# Altium schematic sheet Sheet3.SchDoc
size A4
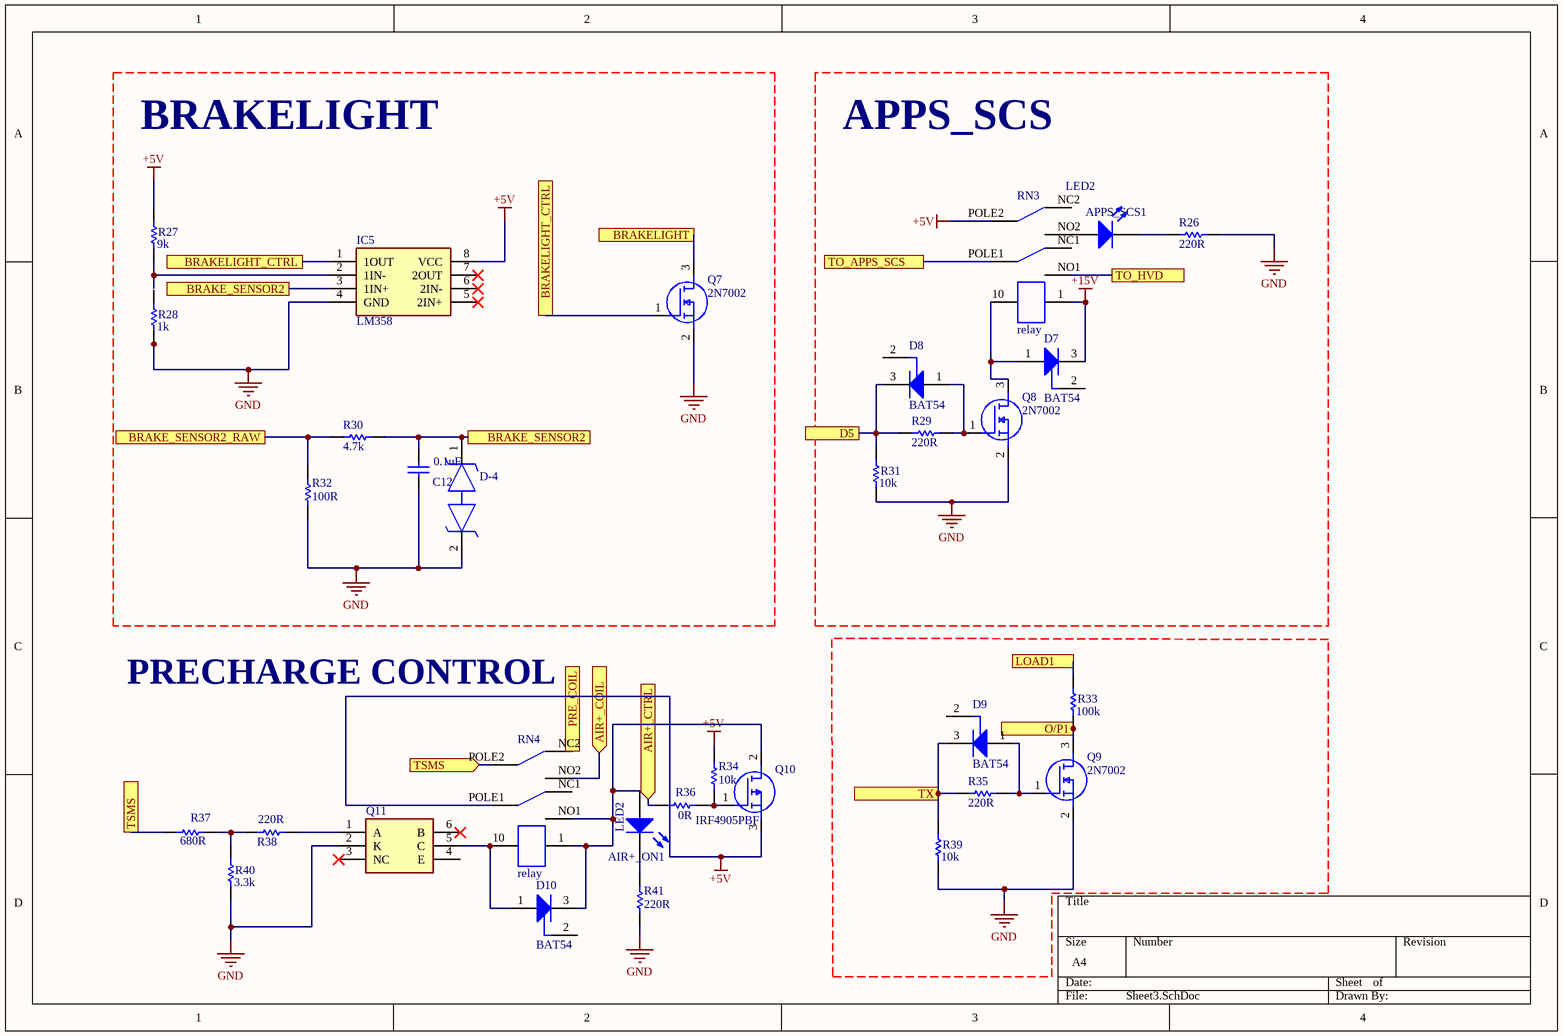
[diagram p0: Sheet3.SchDoc]

## Parts
AIR+_ON1  LED2  [3.2X1.6X1.1]
APPS_SCS1  LED2  [3.2X1.6X1.1]
C12  0.1uF  [KEMT-1206-2_N]
D7  BAT54  [INF-SOT23_N]
D8  BAT54  [INF-SOT23_N]
D9  BAT54  [INF-SOT23_N]
D10  BAT54  [INF-SOT23_N]
D-4  TPD1E6B06DPLR  [R1206]  (value not drawn)
IC5  LM358  [SOP100P600X150-8N]
Q7  2N7002  [SOT96P240X120-3N]
Q8  2N7002  [SOT96P240X120-3N]
Q9  2N7002  [SOT96P240X120-3N]
Q10  IRF4905PBF  [TO254P469X1042X1967-3P]
Q11  MCT2ESM  [SOT254P916X480-6N]  (value not drawn)
R26  220R  [RESC3216X60X45NL10T20 - duplicate]
R27  9k  [RESC3216X60X45NL10T20 - duplicate]
R28  1k  [RESC3216X60X45NL10T20 - duplicate]
R29  220R  [RESC3216X60X45NL10T20 - duplicate]
R30  4.7k  [RESC3216X60X45NL10T20 - duplicate]
R31  10k  [RESC3216X60X45NL10T20 - duplicate]
R32  100R  [RESC3216X60X45NL10T20 - duplicate]
R33  100k  [RESC3216X60X45NL10T20 - duplicate]
R34  10k  [R1206]
R35  220R  [RESC3216X60X45NL10T20 - duplicate]
R36  0R  [R1206]
R37  680R  [RESC3216X60X45NL10T20 - duplicate]
R38  220R  [RESC3216X60X45NL10T20 - duplicate]
R39  10k  [RESC3216X60X45NL10T20 - duplicate]
R40  3.3k  [RESC3216X60X45NL10T20 - duplicate]
R41  220R  [R1206]
RN3  relay  [relaytq]
RN4  relay  [relaytq]

## Blocks framed on the sheet
BRAKELIGHT: C12 D-4 IC5 Q7 R27 R28 R30 R32
APPS_SCS: APPS_SCS1 D7 D8 Q8 R26 R29 R31 RN3

## Ports
AIR+_COIL (in), AIR+_CTRL (in), BRAKE_SENSOR2, BRAKE_SENSOR2_RAW, BRAKELIGHT, BRAKELIGHT_CTRL, D5, LOAD1, O/P1, PRE_COIL, TO_APPS_SCS, TO_HVD, TSMS, TSMS (in), TX

## Nets
+5V: IC5.8(VCC) Q10.3(S) R27.2 R34.2 RN3.POLE2 RN4.POLE1
+15V: D7.3(K) RN3.1
GND: C12.1 D-4.2 IC5.4(GND) Q7.2(S) Q8.2(S) Q9.2(S) Q11.2(K) R26.1 R28.1 R31.1 R32.2 R39.1 R40.1 R41.2
AIR+_COIL: RN4.NO2 ; port AIR+_COIL
AIR+_CTRL: R36.1 ; port AIR+_CTRL
BRAKE_SENSOR2: C12.2 D-4.1 IC5.3(1IN+) R30.1 ; port BRAKE_SENSOR2
BRAKE_SENSOR2_RAW: R30.2 R32.1 ; port BRAKE_SENSOR2_RAW
BRAKELIGHT: Q7.3(D) ; port BRAKELIGHT
BRAKELIGHT_CTRL: IC5.1(1OUT) Q7.1(G) ; port BRAKELIGHT_CTRL
D5: D8.3(K) R29.2 R31.2 ; port D5
LOAD1: R33.2 ; port LOAD1
O/P1: Q9.3(D) R33.1 ; port O/P1
PRE_COIL: RN4.NC2 ; port PRE_COIL
TO_APPS_SCS: RN3.POLE1 ; port TO_APPS_SCS
TO_HVD: RN3.NO1 ; port TO_HVD
TSMS: R37.2 RN4.POLE2 ; port TSMS
TX: D9.3(K) R35.2 R39.2 ; port TX
NetAIR+_ON1_1: AIR+_ON1.1(A) D10.3(K) Q10.2(D) RN4.1 RN4.NO1
NetAIR+_ON1_2: AIR+_ON1.2(K) R41.1
NetAPPS_SCS1_1: APPS_SCS1.1(A) RN3.NO2
NetAPPS_SCS1_2: APPS_SCS1.2(K) R26.2
NetD7_1: D7.1(A) Q8.3(D) RN3.10
NetD8_1: D8.1(A) Q8.1(G) R29.1
NetD9_1: D9.1(A) Q9.1(G) R35.1
NetD10_1: D10.1(A) Q11.5(C) RN4.10
NetIC5_2: IC5.2(1IN-) R27.1
NetQ10_1: Q10.1(G) R34.1 R36.2
NetQ11_1: Q11.1(A) R38.1
NetR37_1: R37.1 R38.2 R40.2

Not connected (* = marked no-connect by the designer): D7 2(NC); D8 2(NC); D9 2(NC); D10 2(NC); IC5 5(2IN+)* 6(2IN-)* 7(2OUT)*; Q11 3(NC)* 4(E) 6(B)*; R28 2; RN3 NC1 NC2; RN4 NC1

## Notes on the sheet
- PRECHARGE CONTROL

## Library data of the parts
AIR+_ON1 APPS_SCS1 = LED2: Typical RED, GREEN, YELLOW, AMBER GaAs LED; Published: 8-Jun-2000; LatestRevisionDate: 17-Jul-2002; LatestRevisionNote: Re-released for DXP Platform.; PackageVersion: Feb-2002; PackageReference: 3.2X1.6X1.1; Publisher: Altium Limited; PackageDescription: SM LED; 2 Flat Leads
C12 = CAPACITOR: CAP, Ceramic, 0.1 uF, +/- 10%, 50 V, -55 to 125 degC, 1206 (3216 Metric), RoHS, Tape and Reel; Manufacturer: Kemet; Voltage Rating: 50V; Capacitance: 0.1µF; Product Range: KEMET-CSeries; SVHC: ToBeAdvised; Dielectric Characteristic: X7R; Capacitor Case Style: 1206[3216Metric]; Package Reference: 1206-2; Package Description: 2-Leads SMD, Body 3.2 x 1.6 mm; Packaging: Tape&Reel; Operating Temperature Max: 125degC; Capacitance Tolerance: ±10%; Datasheet URL: https://datasheet.ciiva.com/6125/1725438-6125494.pdf; Manufacturer URL: http://www.kemet.com/; Operating Temperature Min: -55degC; Datasheet Version: Jul-13
D7-D10 = CMP-1182-00010-1: Silicon Schottky Diode, SOT23, Reel, Green; Manufacturer: Infineon; VF (max): 800Â mV; Configuration: Single; IF (max): 200Â mA; CT (max): 10Â pF; Green: TRUE; VR (max): 30Â V; PartNumber: BAT54; ComponentLink2URL: http://www.infineon.com/dgdl/bat54series.pdf?folderId=db3a30431400ef68011425f1ca2505e3&fileId=db3a304314dca3890115190b74210ea6; ComponentLink3Description: Package Specification; PackageVersion: Apr-08; PackageDescription: 3-Pin Small Outline Transistor Package, 1.3 x 2.9 mm Body, 0.95 mm Pitch; ComponentLink1Description: Manufacturer URL; ComponentLink1URL: http://www.infineon.com/; Mounting Technology: Surface Mount; Packing: Reel; ComponentLink2Description: Datasheet; PackageReference: SOT23; ComponentLink3URL: http://www.infineon.com/dgdl/SOT23-Package_Overview.pdf?folderId=db3a30431936bc4b0119532290053c66&fileId=db3a30431936bc4b0119533468123c85
IC5 = LM358: Integrated Circuit; Manufacturer_Name: IDCHIP; Datasheet Link: https://datasheet.lcsc.com/szlcsc/1902201702_IDCHIP-LM358_C329455.pdf; Height: 1.5mm; Manufacturer_Part_Number: LM358
Q7-Q9 = 2N7002: MOSFET (N-Channel); Manufacturer_Name: Vishay; Datasheet Link: https://www.diodes.com/assets/Datasheets/ds11303.pdf; Height: 1.2mm; Manufacturer_Part_Number: 2N7002; Mouser Part Number: 781-2N7002; Mouser Price/Stock: https://www.mouser.co.uk/ProductDetail/Vishay-Siliconix/2N7002?qs=xBpwZ0JX2zKeuvZKtdYLZQ%3D%3D
Q10 = IRF4905PBF: MOSFET (P-Channel); Manufacturer_Name: Infineon; Datasheet Link: http://docs-emea.rs-online.com/webdocs/0791/0900766b807910f2.pdf; Height: 4.69mm; Manufacturer_Part_Number: IRF4905PBF; Mouser Part Number: 942-IRF4905PBF; Mouser Price/Stock: https://www.mouser.co.uk/ProductDetail/Infineon-IR/IRF4905PBF/?qs=9%252BKlkBgLFf39l0HsWdxvdw%3D%3D; Arrow Part Number: IRF4905PBF; Arrow Price/Stock: https://www.arrow.com/en/products/irf4905pbf/infineon-technologies-ag
Q11 = MCT2ESM: Phototransistor; Manufacturer_Name: ON Semiconductor; Datasheet Link: https://www.onsemi.com/pub/Collateral/MCT2EM-D.PDF; Height: 4.8mm; Manufacturer_Part_Number: MCT2ESM; Mouser Part Number: 512-MCT2ESM; Mouser Price/Stock: https://www.mouser.co.uk/ProductDetail/ON-Semiconductor-Fairchild/MCT2ESM/?qs=nW0pe8qlIZjLnc6UyUzYTw%3D%3D; Arrow Part Number: MCT2ESM; Arrow Price/Stock: https://www.arrow.com/en/products/mct2esm/on-semiconductor
R26-R33 R35 R37-R40 = CMP-2003-02213-1: Part Number: CRCW120647K0FKEA; Manufacturer: Vishay Dale
R34 R36 R41 = RES: Part Number: CRCW120647K0FKEA; Manufacturer: Vishay Dale